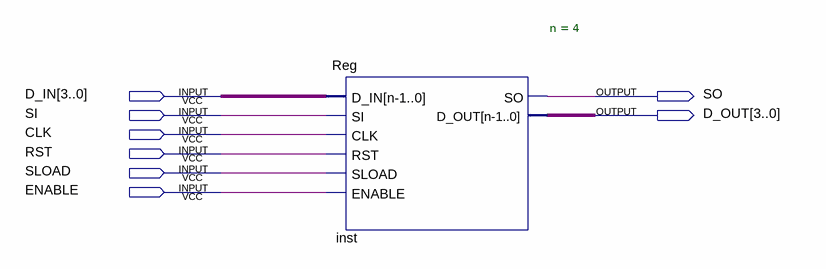
[diagram p0: schematic sheet]
// Quartus schematic REGISTER.bdf as structural Verilog: 1 symbols, 8 pins
module REGISTER (
  input  [3:0] D_IN,
  input  SI,
  input  CLK,
  input  RST,
  input  SLOAD,
  input  ENABLE,
  output SO,
  output [3:0] D_OUT
);

  Reg #(.n(4)) inst (
    .D_IN(D_IN), .SI(SI), .CLK(CLK), .RST(RST), .SLOAD(SLOAD), .ENABLE(ENABLE), .SO(SO), .D_OUT(D_OUT));
endmodule
